# Altium schematic sheet primary_internship.SchDoc
size A0; SheetNumber: 2; SheetTotal: 2
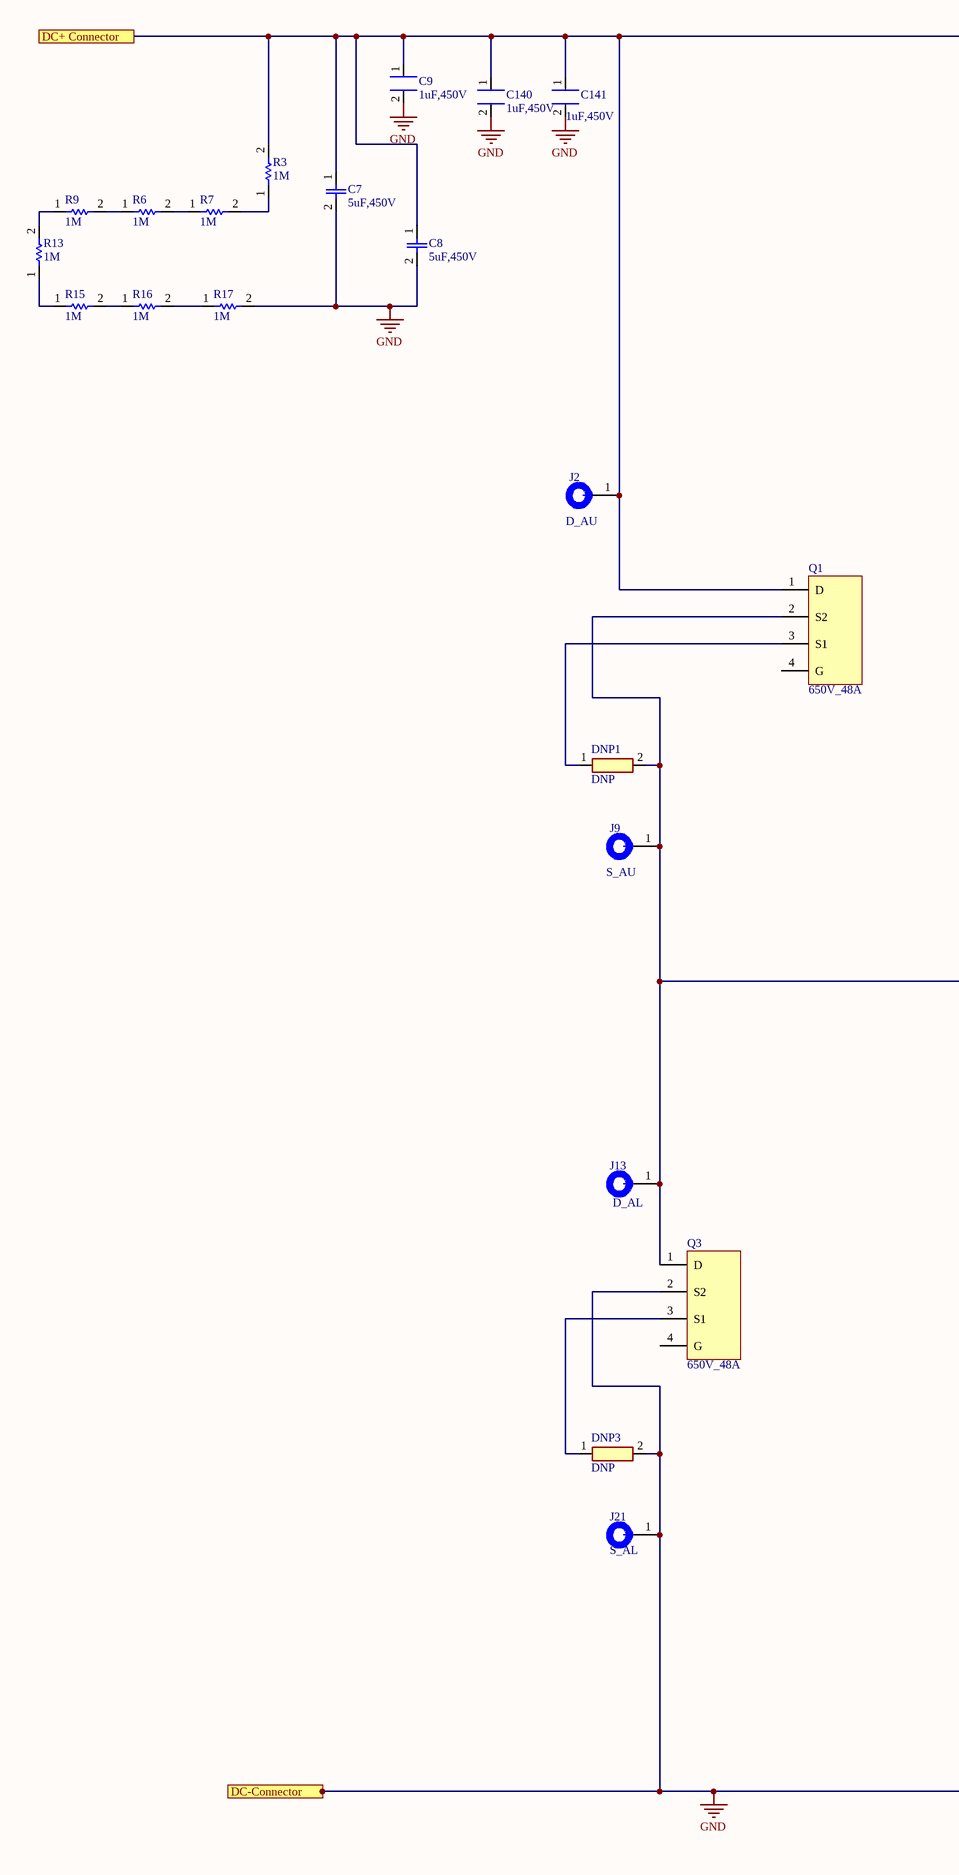
[diagram p0: primary_internship.SchDoc, left]
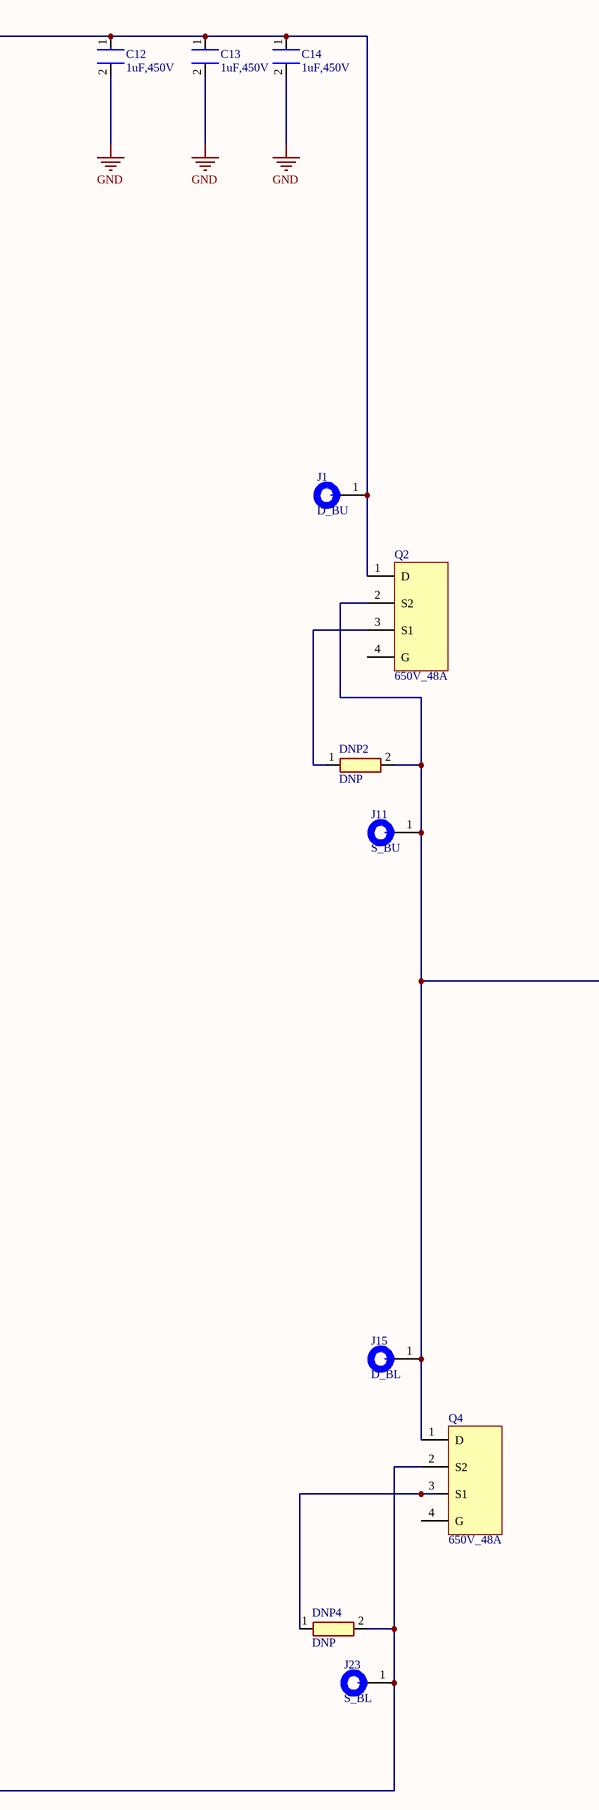
[diagram p1: primary_internship.SchDoc, right]

## Parts
C7  5uF,450V  [CAP_B32774D4505K000_TDK]
C8  5uF,450V  [CAP_B32774D4505K000_TDK]
C9  1uF,450V  [CAP_5035_TDK]
C12  1uF,450V  [CAP_5035_TDK]
C13  1uF,450V  [CAP_5035_TDK]
C14  1uF,450V  [CAP_5035_TDK]
C140  1uF,450V  [CAP_5035_TDK]
C141  1uF,450V  [CAP_5035_TDK]
DNP1  DNP  [RC1206N_YAG]
DNP2  DNP  [RC1206N_YAG]
DNP3  DNP  [RC1206N_YAG]
DNP4  DNP  [RC1206N_YAG]
J1  D_BU  [FP-S2751-46R-MFG]
J2  D_AU  [FP-S2751-46R-MFG]
J9  S_AU  [FP-S2751-46R-MFG]
J11  S_BU  [FP-S2751-46R-MFG]
J13  D_AL  [FP-S2751-46R-MFG]
J15  D_BL  [FP-S2751-46R-MFG]
J21  S_AL  [FP-S2751-46R-MFG]
J23  S_BL  [FP-S2751-46R-MFG]
Q1  650V_48A
Q2  650V_48A
Q3  650V_48A
Q4  650V_48A
R3  1M  [RESC3216X70X50LL05T20]
R6  1M  [RESC3216X70X50LL05T20]
R7  1M  [RESC3216X70X50LL05T20]
R9  1M  [RESC3216X70X50LL05T20]
R13  1M  [RESC3216X70X50LL05T20]
R15  1M  [RESC3216X70X50LL05T20]
R16  1M  [RESC3216X70X50LL05T20]
R17  1M  [RESC3216X70X50LL05T20]

## Ports
DC+ Connector, DC-Connector

## Nets
GND: C7.2 C8.2 C9.2 C12.2 C13.2 C14.2 C140.2 C141.2 DNP3.2 DNP4.2 J21.1 J23.1 Q3.2(S2) Q4.2(S2) R17.2 ; port DC-Connector
DC+ Connector: C7.1 C8.1 C9.1 C12.1 C13.1 C14.1 C140.1 C141.1 J1.1 J2.1 Q1.1(D) Q2.1(D) R3.2 ; port DC+ Connector
NetDNP1_1: DNP1.1 Q1.3(S1)
NetDNP1_2: DNP1.2 J9.1 J13.1 Q1.2(S2) Q3.1(D)
NetDNP2_1: DNP2.1 Q2.3(S1)
NetDNP2_2: DNP2.2 J11.1 J15.1 Q2.2(S2) Q4.1(D)
NetDNP3_1: DNP3.1 Q3.3(S1)
NetDNP4_1: DNP4.1 Q4.3(S1)
NetR3_1: R3.1 R7.2
NetR6_1: R6.1 R9.2
NetR6_2: R6.2 R7.1
NetR9_1: R9.1 R13.2
NetR13_1: R13.1 R15.1
NetR15_2: R15.2 R16.1
NetR16_2: R16.2 R17.1

Not connected (* = marked no-connect by the designer): Q1 4(G); Q2 4(G); Q3 4(G); Q4 4(G)

## Library data of the parts
C7 C8 = B32774D4505K000: 5 µF Film Capacitor 450V Polypropylene (PP), Metallized Radial; Mfr_Name: TDK; Digi-Key_Part_Number_1: 495-4828-ND
C9 C12-C14 C140 C141 = CKG45NX7T2W105M500JH: 1 µF ±20% 450V Ceramic Capacitor X7T Stacked SMD, 2 J-Lead; Mfr_Name: TDK; Digi-Key_Part_Number_3: 445-7100-6-ND; Digi-Key_Part_Number_2: 445-7100-2-ND; Digi-Key_Part_Number_1: 445-7100-1-ND
DNP1-DNP4 = RC1206FR-078R2L: 8.2 Ohms ±1% 0.25W, 1/4W Chip Resistor 1206 (3216 Metric) Moisture Resistant Thick Film; Mfr_Name: Yageo; Digi-Key_Part_Number_3: 311-8.20FRTR-ND; Digi-Key_Part_Number_2: 311-8.20FRDKR-ND; Digi-Key_Part_Number_1: 311-8.20FRCT-ND
J1 J2 J9 J11 J13 J15 J21 J23 = CMP-15817-000010-1: PC TEST POINT NATURAL; Plating: Tin; Body Material: Brass; Color: Natural; Material: Copper Alloy; Mount: Surface Mount; Packaging: Cut Tape
Q1-Q4 = SIC MOS TO247-4L 650V: N-Channel 650 V 47A (Tc) 176W (Tc) Through Hole TO-247-4L
R3 R6 R7 R9 R13 R15-R17 = CMP-2003-00309-1: Thick Film Resistors - SMD 1206 1Mohms 1% Tol AEC-Q200; Manufacturer: Panasonic; Part Number: ERJ-8ENF3321V